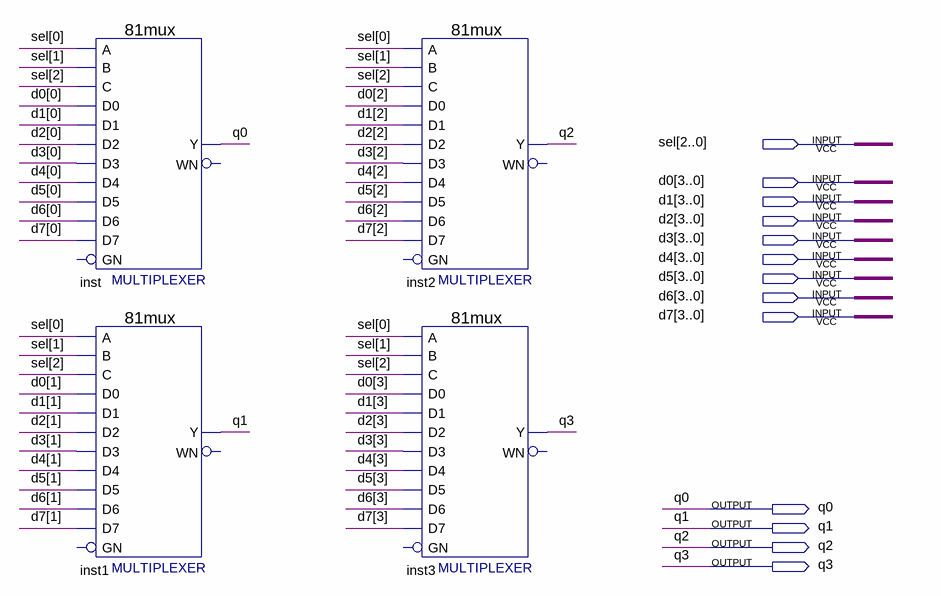
[diagram p0: schematic sheet]
// Quartus schematic 81mux4.bdf as structural Verilog: 4 symbols, 13 pins
module \81mux4  (
  input  [2:0] sel,
  input  [3:0] d0,
  input  [3:0] d1,
  input  [3:0] d2,
  input  [3:0] d3,
  input  [3:0] d4,
  input  [3:0] d5,
  input  [3:0] d6,
  input  [3:0] d7,
  output q0,
  output q1,
  output q2,
  output q3
);

  \81mux  inst (
    .C(sel[2]), .D1(d1[0]), .D0(d0[0]), .D5(d5[0]), .D4(d4[0]), .D2(d2[0]), .D3(d3[0]), .D7(d7[0]),
    .D6(d6[0]), .A(sel[0]), .B(sel[1]), .Y(q0));  // open: GN, WN
  \81mux  inst1 (
    .C(sel[2]), .D1(d1[1]), .D0(d0[1]), .D5(d5[1]), .D4(d4[1]), .D2(d2[1]), .D3(d3[1]), .D7(d7[1]),
    .D6(d6[1]), .A(sel[0]), .B(sel[1]), .Y(q1));  // open: GN, WN
  \81mux  inst2 (
    .C(sel[2]), .D1(d1[2]), .D0(d0[2]), .D5(d5[2]), .D4(d4[2]), .D2(d2[2]), .D3(d3[2]), .D7(d7[2]),
    .D6(d6[2]), .A(sel[0]), .B(sel[1]), .Y(q2));  // open: GN, WN
  \81mux  inst3 (
    .C(sel[2]), .D1(d1[3]), .D0(d0[3]), .D5(d5[3]), .D4(d4[3]), .D2(d2[3]), .D3(d3[3]), .D7(d7[3]),
    .D6(d6[3]), .A(sel[0]), .B(sel[1]), .Y(q3));  // open: GN, WN
endmodule
